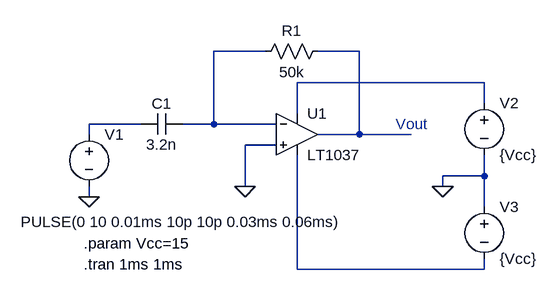
[diagram p0: schematic scheme12.asc]
scheme12.asc, the LTspice schematic file:
Version 4.1
SHEET 1 880 680
WIRE 144 48 64 48
WIRE 288 48 224 48
WIRE 480 96 192 96
WIRE 480 128 480 96
WIRE 192 144 192 96
WIRE -48 160 -128 160
WIRE 64 160 64 48
WIRE 64 160 16 160
WIRE 160 160 64 160
WIRE -128 176 -128 160
WIRE 288 176 288 48
WIRE 288 176 224 176
WIRE 368 176 288 176
WIRE 160 192 112 192
WIRE 480 240 480 208
WIRE 480 240 416 240
WIRE 112 256 112 192
WIRE 416 256 416 240
WIRE -128 272 -128 256
WIRE 480 288 480 240
WIRE 192 384 192 208
WIRE 480 384 480 368
WIRE 480 384 192 384
FLAG -128 272 0
FLAG 112 256 0
FLAG 416 256 0
SYMBOL OpAmps\\LT1037 192 112 R0
SYMATTR InstName U1
SYMBOL voltage -128 160 R0
WINDOW 123 24 124 Left 2
WINDOW 39 0 0 Left 0
WINDOW 3 -105 151 Left 2
SYMATTR Value PULSE(0 10 0.01ms 10p 10p 0.03ms 0.06ms)
SYMATTR InstName V1
SYMBOL res 240 32 R90
WINDOW 0 0 56 VBottom 2
WINDOW 3 32 56 VTop 2
SYMATTR InstName R1
SYMATTR Value 50k
SYMBOL voltage 480 112 R0
SYMATTR InstName V2
SYMATTR Value {Vcc}
SYMBOL voltage 480 272 R0
SYMATTR InstName V3
SYMATTR Value {Vcc}
SYMBOL cap 16 144 R90
WINDOW 0 0 32 VBottom 2
WINDOW 3 32 32 VTop 2
SYMATTR InstName C1
SYMATTR Value 3.2n
TEXT -136 344 Left 2 !.param Vcc=15
TEXT 344 160 Left 2 ;Vout
TEXT -136 376 Left 2 !.tran 1ms 1ms

The netlist it stands for:
* scheme12.asc
X§U1 0 N001 N003 N005 N002 LT1037  ; pins In+ In- V+ V- OUT
V1 N004 0 PULSE(0 10 0.01ms 10p 10p 0.03ms 0.06ms)
R1 N002 N001 50k
V2 N003 0 {Vcc}
V3 0 N005 {Vcc}
C1 N001 N004 3.2n
.param Vcc=15
* Vout
.tran 1ms 1ms
.backanno
.end